# Altium schematic sheet 6106 RC522门禁卡.SchDoc
size A4
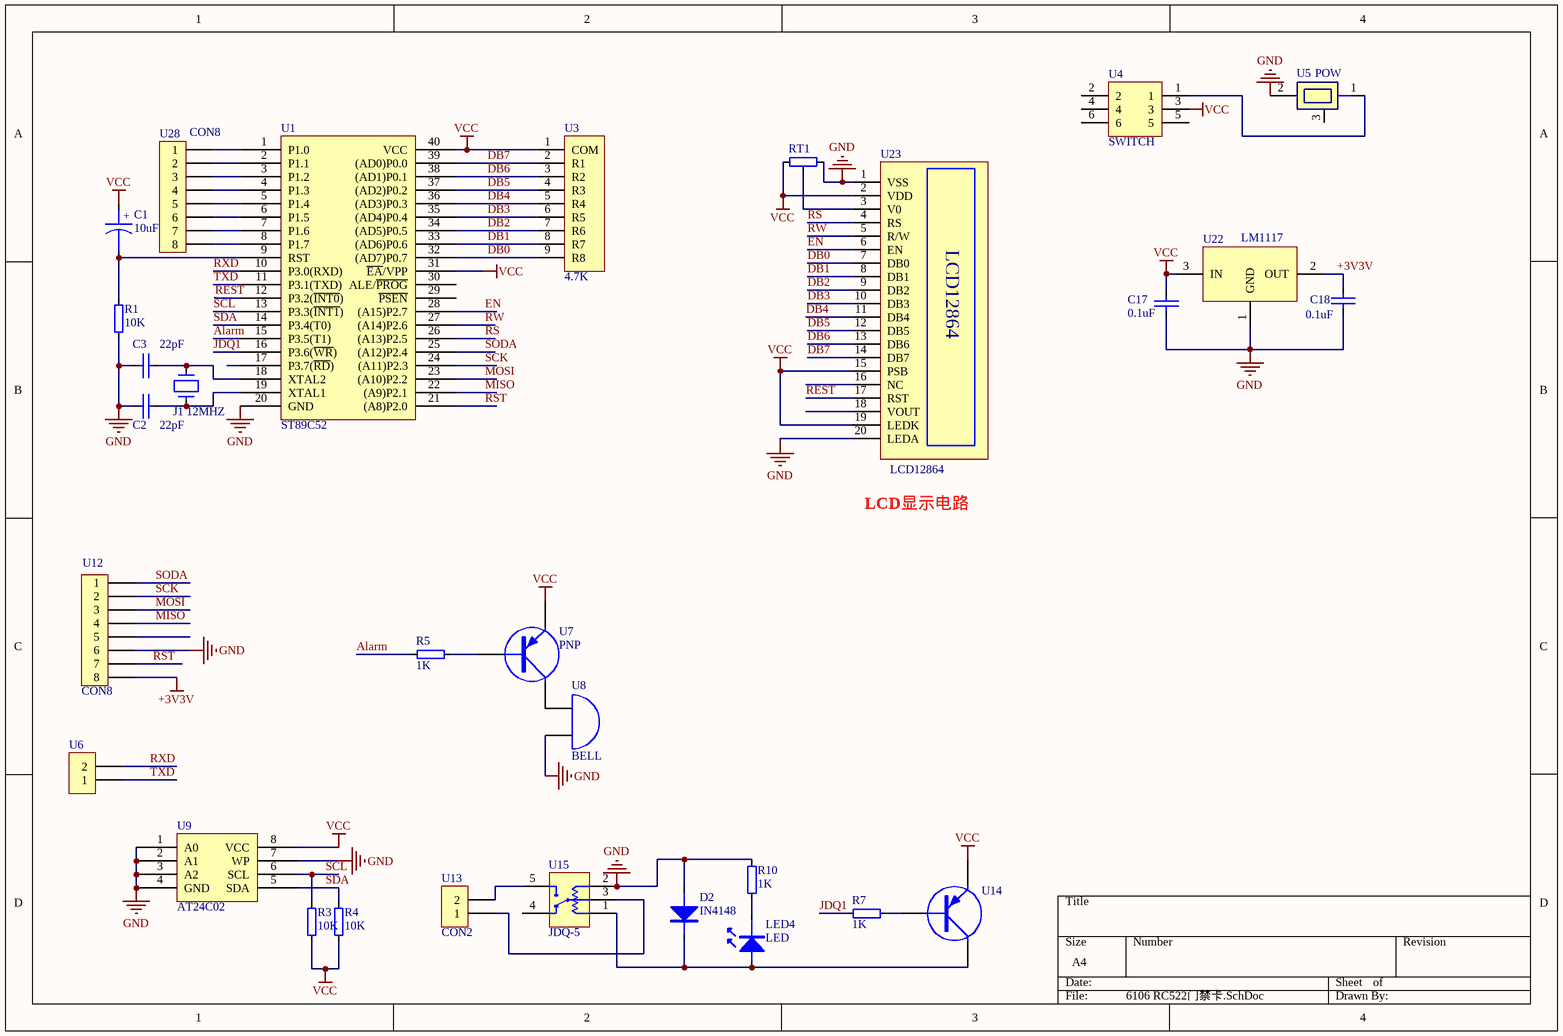
[diagram p0: 6106 RC522门禁卡.SchDoc]

## Parts
C1  10uF  [C10]
C2  22pF  [CAP]
C3  22pF  [CAP]
C17  0.1uF  [CAP]
C18  0.1uF  [CAP]
D2  IN4148  [IN4148]
J1  12MHZ  [CRYSTAL]
LED4  LED  [LED]
R1  10K  [R-DIP]
R3  10K  [R-DIP]
R4  10K  [R-DIP]
R5  1K  [R-DIP]
R7  1K  [R-DIP]
R10  1K  [R-DIP]
RT1  (no value)  [RT1]
U1  ST89C52  [STC]
U3  4.7K  [SIP9]
U4  SWITCH  [SWITCH]
U5  POW  [DCM]
U6  (no value)  [SIP2]
U7  PNP  [PNP]
U8  BELL  [BEEP]
U9  AT24C02  [DIP8]
U12  CON8  [SIP8]
U13  CON2  [SIP2]
U14  (no value)  [PNP]
U15  JDQ-5  [JDQ-5]
U22  LM1117  [7805]
U23  LCD12864  [SIP20]
U28  CON8  [SIP8]

## Nets
+3V3V: C18.2 U12.8 U22.2(OUT)
GND: C2.1 C3.1 C17.1 C18.1 D2.1(A) R1.2 R10.1 RT1.1 U1.20(GND) U5.2 U8.2(B) U9.1(A0) U9.2(A1) U9.3(A2) U9.4(GND) U9.7(WP) U12.6 U15.2 U22.1(GND) U23.1(VSS) U23.20(LEDA)
VCC: C1.1 C17.2 R3.1 R4.1 RT1.2 U1.31(~{EA}/VPP) U1.40(VCC) U3.1(COM) U4.3 U7.2(E) U9.8(VCC) U14.2(E) U22.3(IN) U23.2(VDD) U23.15(PSB) U23.19(LEDK)
Alarm: R5.1 U1.15(P3.5(T1))
DB0: U1.32((AD7)P0.7) U3.9(R8) U23.7(DB0)
DB1: U1.33((AD6)P0.6) U3.8(R7) U23.8(DB1)
DB2: U1.34((AD5)P0.5) U3.7(R6) U23.9(DB2)
DB3: U1.35((AD4)P0.4) U3.6(R5) U23.10(DB3)
DB4: U1.36((AD3)P0.3) U3.5(R4) U23.11(DB4)
DB5: U1.37((AD2)P0.2) U3.4(R3) U23.12(DB5)
DB6: U1.38((AD1)P0.1) U3.3(R2) U23.13(DB6)
DB7: U1.39((AD0)P0.0) U3.2(R1) U23.14(DB7)
EN: U1.28((A15)P2.7) U23.6(EN)
JDQ1: R7.1 U1.16(P3.6(~{WR}))
MISO: U1.22((A9)P2.1) U12.4
MOSI: U1.23((A10)P2.2) U12.3
REST: U1.12(P3.2(~{INT0})) U23.17(RST)
RS: U1.26((A13)P2.5) U23.4(RS)
RST: U1.21((A8)P2.0) U12.7
RW: U1.27((A14)P2.6) U23.5(R/W)
RXD: U1.10(P3.0(RXD)) U6.2
SCK: U1.24((A11)P2.3) U12.2
SCL: R3.2 U1.13(P3.3(~{INT1})) U9.6(SCL)
SDA: R4.2 U1.14(P3.4(T0)) U9.5(SDA)
SODA: U1.25((A12)P2.4) U12.1
TXD: U1.11(P3.1(TXD)) U6.1
NetC1_2: C1.2 R1.1 U1.9(RST)
NetC2_2: C2.2 J1.2 U1.18(XTAL2)
NetC3_2: C3.2 J1.1 U1.19(XTAL1)
NetD2_2: D2.2(K) LED4.1 U14.3(C) U15.1
NetLED4_2: LED4.2 R10.2
NetR5_2: R5.2 U7.1(B)
NetR7_2: R7.2 U14.1(B)
NetRT1_3: RT1.3 U23.3(V0)
NetU1_1: U1.1(P1.0) U28.1
NetU1_2: U1.2(P1.1) U28.2
NetU1_3: U1.3(P1.2) U28.3
NetU1_4: U1.4(P1.3) U28.4
NetU1_5: U1.5(P1.4) U28.5
NetU1_6: U1.6(P1.5) U28.6
NetU1_7: U1.7(P1.6) U28.7
NetU1_8: U1.8(P1.7) U28.8
NetU4_1: U4.1 U5.1
NetU7_3: U7.3(C) U8.1(A)
NetU13_1: U13.1 U15.3(IN)
NetU13_2: U13.2 U15.5(IN)

Not connected (* = marked no-connect by the designer): U1 17(P3.7(~{RD})) 29(~{PSEN}) 30(ALE/~{PROG}); U4 2 4 5 6; U5 3; U12 5; U15 4(IN); U23 16(NC) 18(VOUT)

## Notes on the sheet
- LCD显示电路
- (in symbol 10uF) +

## Library data of the parts
C2 C3 = 0.1uF
D2 = DIODE
J1 = CRYSTAL
R3 R4 = 1K
RT1 = RT
U1 = STC51
U3 = PAIZU
U6 = CON2
U14 = PNP